# EAGLE design sensorAA (EAGLE 6.4)
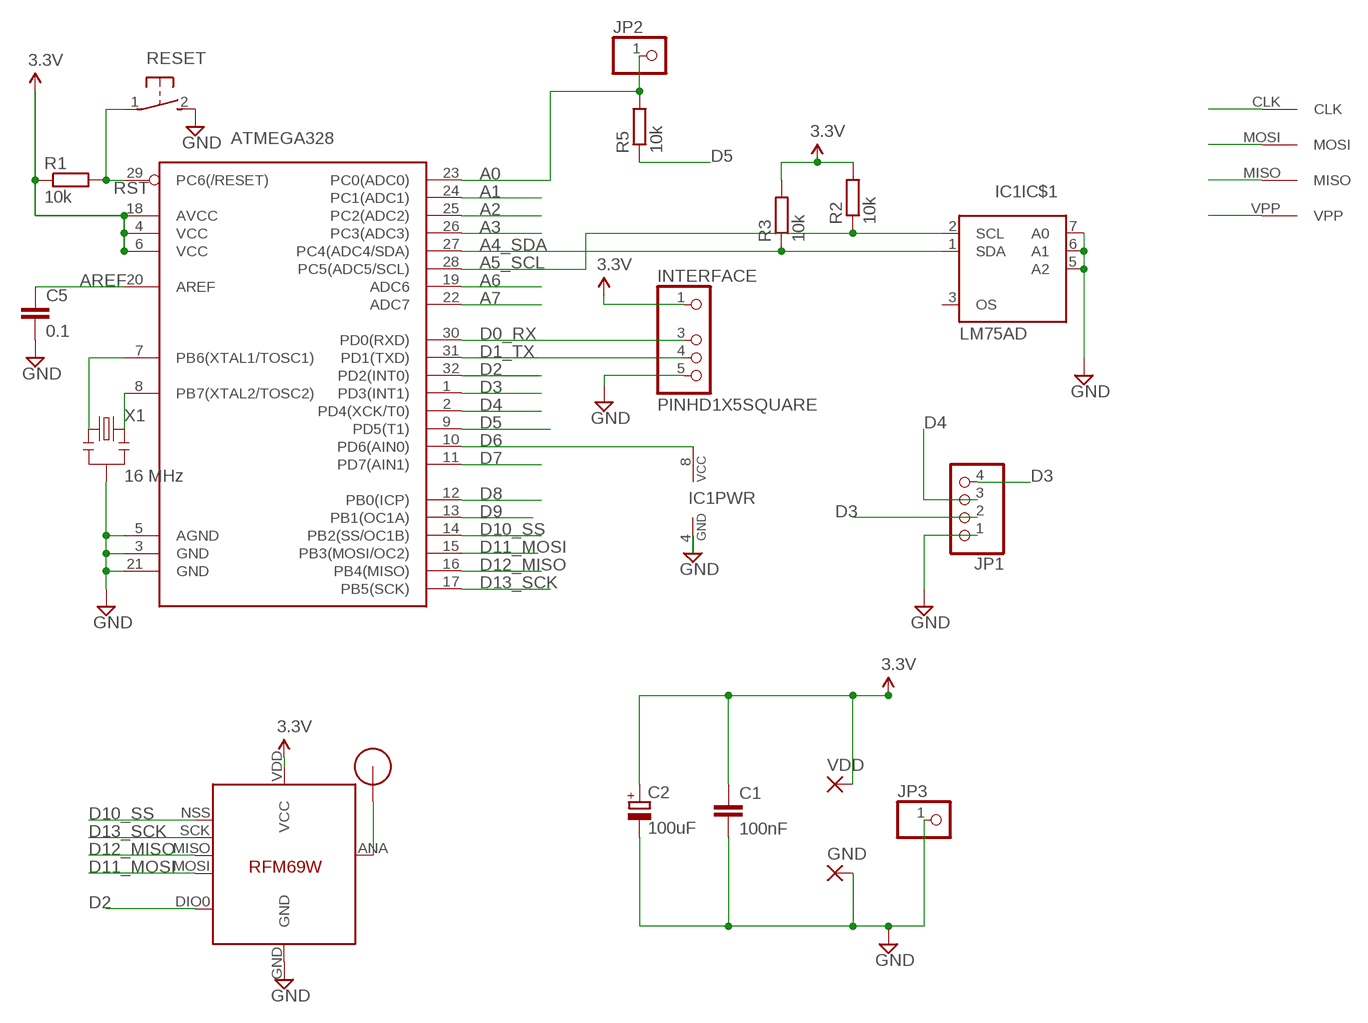
[diagram p0: schematic, sheet 1]

## Parts
ATMEGA328  ATMega-328  ATMEGA168/328TQFP32  [TQFP32-08]
C1  100nF  C-EUC2012  [C2012]
C2  100uF  CPOL-EUSMCB  [SMC_B]
C5  0.1  C-EUC2012  [C2012]
GND  SMD5  [SMD2,54-5,08]
IC1  LM75AD  [SO08]
IC4  RFM69  [RFM69W-MINPADS]
INTERFACE  PINHD1X5SQUARE  [PINHD1X05-SQUARE]
JP1  PINHD-1X04_2.54-S  [1X04-S]
JP2  PINHD-1X01_2.54  [1X01]
JP3  PINHD-1X01_2.54  [1X01]
R1  10k  R-EU_R2012  [R2012]
R2  10k  R-EU_R2012  [R2012]
R3  10k  R-EU_R2012  [R2012]
R5  10k  R-EU_R2012  [R2012]
RESET  DTSM-3  [DTSM-3]
U$1  RFM12B_ANTENNA  [RFM12B-ANTENNA]
U$2  AVRHEADERDIP  [AVRHEADER]
VDD  SMD5  [SMD2,54-5,08]
X1  16 MHz  RESONATORSMD  [RESONATOR-SMD]

## Nets
A0: ATMEGA328.23(PC0(ADC0)) JP2.1 R5.2
A1: ATMEGA328.24(PC1(ADC1))
A2: ATMEGA328.25(PC2(ADC2))
A3: ATMEGA328.26(PC3(ADC3))
A4_SDA: ATMEGA328.27(PC4(ADC4/SDA)) IC1.1(IC$1:SDA) R3.1
A5_SCL: ATMEGA328.28(PC5(ADC5/SCL)) IC1.2(IC$1:SCL) R2.1
A6: ATMEGA328.19(ADC6)
A7: ATMEGA328.22(ADC7)
AREF: ATMEGA328.20(AREF) C5.1
D0_RX: ATMEGA328.30(PD0(RXD)) INTERFACE.3
D1_TX: ATMEGA328.31(PD1(TXD)) INTERFACE.4
D2: ATMEGA328.32(PD2(INT0)) IC4.DIO0
D3: ATMEGA328.1(PD3(INT1)) JP1.2 JP1.4
D4: ATMEGA328.2(PD4(XCK/T0)) JP1.3
D5: ATMEGA328.9(PD5(T1)) R5.1
D6: ATMEGA328.10(PD6(AIN0)) IC1.8(PWR:VCC)
D7: ATMEGA328.11(PD7(AIN1))
D8: ATMEGA328.12(PB0(ICP))
D9: ATMEGA328.13(PB1(OC1A))
D10_SS: ATMEGA328.14(PB2(SS/OC1B)) IC4.NSS(SEL)
D11_MOSI: ATMEGA328.15(PB3(MOSI/OC2)) IC4.MOSI U$2.MOSI
D12_MISO: ATMEGA328.16(PB4(MISO)) IC4.MISO U$2.MISO
D13_SCK: ATMEGA328.17(PB5(SCK)) IC4.SCK U$2.CLK
GND: ATMEGA328.3(GND) ATMEGA328.5(AGND) ATMEGA328.21(GND) C1.2 C2.- C5.2 GND.1(P) IC1.4(PWR:GND) IC1.5(IC$1:A2) IC1.6(IC$1:A1) IC1.7(IC$1:A0) IC4.GND INTERFACE.5 JP1.1 JP3.1 RESET.2 X1.2
N$1: ATMEGA328.7(PB6(XTAL1/TOSC1)) X1.1
N$3: IC4.ANA(ANT) U$1.P$1
N$21: ATMEGA328.8(PB7(XTAL2/TOSC2)) X1.3
RST: ATMEGA328.29(PC6(/RESET)) R1.2 RESET.1 U$2.VPP
VCC: ATMEGA328.4(VCC) ATMEGA328.6(VCC) ATMEGA328.18(AVCC) C1.1 C2.+ IC4.VDD(VCC) INTERFACE.1 R1.1 R2.2 R3.2 VDD.1(P) ; supply symbol labelled 3.3V
Unconnected: IC1.3(IC$1:OS)

## Library data of the parts
ATMEGA328 = LowPowerLab:ATMEGA168/328: Atmel 32-pin 8-bit micro, 16k flash.
C1 C5 = resistor:C-EU: CAPACITOR, European symbol
C2 = resistor:CPOL-EU: POLARIZED CAPACITOR, European symbol
GND VDD = wirepad:SMD5: SMD PAD
IC1 = i2c:LM75AD: Digital Temperature Sensor and Thermal Watchdog
IC4 = LowPowerLab:RFM69
INTERFACE = eagle-library-edeca.net-v5:PINHD1X5
JP1 = pinhead-2:PINHD-1X04: PIN HEADER
JP2 JP3 = pinhead-2:PINHD-1X01: PIN HEADER
R1-R3 R5 = resistor:R-EU_: RESISTOR, European symbol
RESET = switch-tact:DTSM-3
U$1 = LowPowerLab:RFM12B_ANTENNA
U$2 = RemoteHome:AVRHEADER
X1 = SparkFun:RESONATOR: Resonator Small SMD resonator. This is the itty bitty 10/20MHz resonators with built in caps. CSTCE10M0G55 and CSTCE20M0V53. Footprint has been reviewed closely but hasn't been tested yet.

## Net classes
1 power: width 0.381 mm, clearance 0.254 mm

## Board
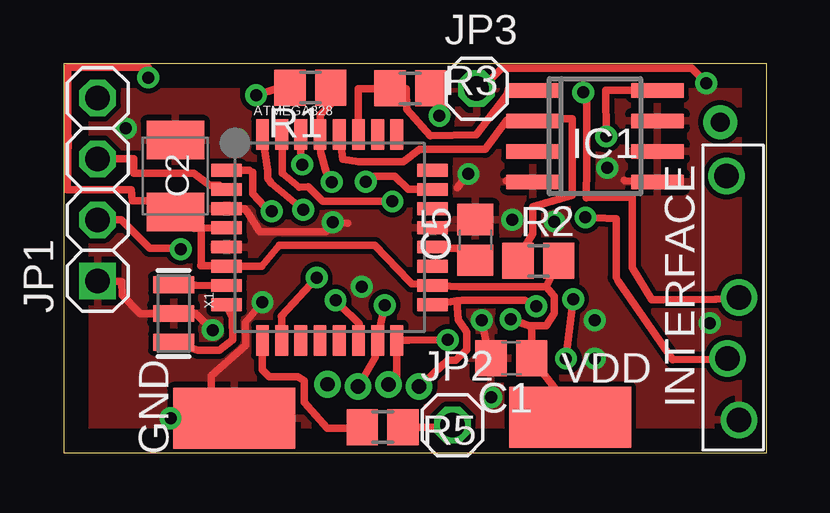
[diagram p1: board, top side]
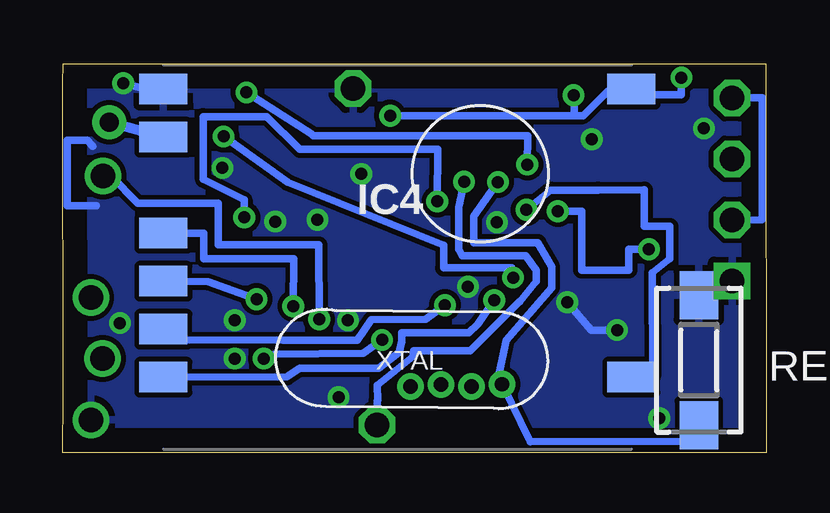
[diagram p2: board, bottom side, seen from below]

Size 29.3 x 16.2 mm. Coordinates in mm from the lower left corner, seen from the top.
Outline: 0,0 29.3,0 29.29,2.34 29.29,15.39 29.29,16.2 0.01,16.2 0,0
Copper layers (1*16): Top 0.035mm / dielectric 1.5mm / Bottom 0.035mm
Design rules "default": minimum track width 10mil, minimum drill 24mil, track to track 8mil, track to pad 8mil, pad to pad 8mil, via to via 8mil, smd to smd 8mil, copper to edge 40mil, drill to drill 8mil, minimum pad ring 10mil, minimum via ring 8mil, stop-mask expansion 4mil, vias tented up to drill 0mil, thermal gap 10mil

### Footprints (pad centres in the part's own frame; a part is rotated, then mirrored left to right if it is on the bottom)
TQFP32-08 = smd 1.27 x 0.533: 1 -4.293,2.8; 2 -4.293,2; 3 -4.293,1.2; 4 -4.293,0.4; 5 -4.293,-0.4; 6 -4.293,-1.2; 7 -4.293,-2; 8 -4.293,-2.8; 17 4.293,-2.8; 18 4.293,-2; 19 4.293,-1.2; 20 4.293,-0.4; 21 4.293,0.4; 22 4.293,1.2; 23 4.293,2; 24 4.293,2.8 | smd 0.533 x 1.27: 9 -2.8,-4.293; 10 -2,-4.293; 11 -1.2,-4.293; 12 -0.4,-4.293; 13 0.4,-4.293; 14 1.2,-4.293; 15 2,-4.293; 16 2.8,-4.293; 25 2.8,4.293; 26 2,4.293; 27 1.2,4.293; 28 0.4,4.293; 29 -0.4,4.293; 30 -1.2,4.293; 31 -2,4.293; 32 -2.8,4.293
C2012 = smd 1.3 x 1.5: 1 -0.85,0; 2 0.85,0
SMC_B = smd 1.6 x 2.4: + -1.5,0; - 1.5,0
SMD2,54-5,08 = smd 2.54 x 5.08: 1 0,0
SO08 = smd 0.6 x 2.2: 1 -1.905,-2.6; 2 -0.635,-2.6; 3 0.635,-2.6; 4 1.905,-2.6; 5 1.905,2.6; 6 0.635,2.6; 7 -0.635,2.6; 8 -1.905,2.6
RFM69W-MINPADS = smd 2 x 1.27: ANA 8,-5; DIO0 -11.5,5; GND 8,-7; MISO 8,1; MOSI 8,3; NSS 8,5; SCK 8,-1; VDD -11.5,-7
PINHD1X05-SQUARE = drill 1.016: 1 -5.061,-0.269; 3 0,0.24; 4 2.54,-0.24; 5 5.099,0.24
1X04-S = drill 1.016 square: 1 -3.81,0 | drill 1.016 octagon: 2 -1.27,0; 3 1.27,0; 4 3.81,0
1X01 = drill 1.016 octagon: 1 0,0
R2012 = smd 1.3 x 1.5: 1 -0.85,0; 2 0.85,0
DTSM-3 = smd 2 x 1.6: 1 -2.7,0; 2 2.7,0
RFM12B-ANTENNA = drill 0.8 pad 1.422: P$1 0,0
AVRHEADER = drill 0.6 pad 0.813: CLK 2.54,0; MISO 1.27,0.091; MOSI 0,0; VPP -1.27,0.099
RESONATOR-SMD = smd 0.7 x 1.7: 1 -1.2,0; 2 0,0; 3 1.2,0

### Placement (x,y rotation side)
ATMEGA328  11.09,8.96 0 top
C1  18.66,3.93 180 top
C2  4.65,11.52 90 top
C5  17.16,8.86 90 top
GND  7.1,1.42 90 top
IC1  22.14,13.18 270 top
IC4  17.11,8.15 180 bottom
INTERFACE  27.9,6.46 270 top
JP1  1.41,10.96 90 top
JP2  16.2,1.15 0 top
JP3  17.2,15.17 0 top
R1  10.28,15.21 0 top
R2  19.78,7.99 0 top
R3  14.44,15.17 0 top
R5  13.29,1.06 0 top
RESET  2.8,3.85 90 bottom
U$1  27.36,13.77 0 top
U$2  12.27,2.74 0 top
VDD  21.1,1.47 90 top
X1  4.58,5.8 270 top

### Tracks (layer width: path | path; a pad name or v marks a point on that pad's centre or on a via)
A0  (via drill 0.5)
  Top 0.305: ATMEGA328.23 14.35,10.96 13.8,11.51 12.95,11.51 v12.58,11.28 | R5.2 16.12,1.06 JP2.1
  Bottom 0.305: v12.58,11.28 12.79,10.22 12.81,10.09 12.81,8.92 12.81,8.81 12.81,8.47 12.66,8.2 10.01,8.2 9.57,7.6 9.57,7.15 10.27,6.28 10.29,6.28 12.33,4.25 14.69,4.24 14.69,4.02 16.19,2.8 16.18,2.19 16.2,2.16 JP2.1
A4_SDA
  Top 0.305: IC1.1 18.55,15.19 18.49,14.94 17.2,13.23 15.27,13.19 14.3,14.29 14.28,15.15 R3.1 14.03,15.15 12.29,15.15 ATMEGA328.27
A5_SCL
  Top 0.305: ATMEGA328.28 11.5,13.24 11.64,12.23 12.3,12.12 14.16,12.12 14.83,12.65 17.56,12.63 18.45,13.85 IC1.2 18.84,13.91 21.18,13.91 21.18,10.73 19.54,10.24 19.54,9.13 18.92,8.09 R2.1
AREF
  Top 0.305: ATMEGA328.20 15.43,8.51 16.41,8.51 17.01,7.91 C5.1
D0_RX  (via drill 0.5)
  Top 0.305: ATMEGA328.30 9.89,12.22 v9.95,12 | v21.65,15.01 21.8,15.01 21.79,14.23 21.79,12.05 21.79,11.93 21.77,10.61 23.7,10.64 23.69,7.71 24.51,6.37 | 24.99,6.37 24.51,6.37 | 24.51,6.37 27.17,6.39 INTERFACE.3
  Bottom 0.305: v9.95,12 9.93,13.21 10.24,13.2 18.86,13.2 18.95,13.29 v21.65,15.01
D1_TX  (via drill 0.5)
  Top 0.305: v13.7,10.46 10.8,10.46 10.18,11.08 9.83,11.05 9.11,11.63 9.1,13.24 ATMEGA328.31 | v21.74,9.79 23.02,9.75 23.03,7.3 23.11,7.14 25.39,3.86 27.2,3.89 INTERFACE.4
  Bottom 0.305: v13.7,10.46 13.7,10.51 13.69,10.52 13.68,12.63 19.43,12.63 20.8,14 23.46,14 23.45,11.38 21.74,10.53 v21.74,9.79
D2  (via drill 0.5)
  Top 0.305: ATMEGA328.32 8.5,11.75 8.51,11.44 8.65,11.22 v9.99,10.11
  Bottom 0.305: v9.99,10.11 8.96,10.94 7.01,10.94 6.99,10.93 5.07,10.95 5.07,9.43 4,9.43 4.01,8.07 4.74,7.5 4.72,3.17 IC4.DIO0
D3  (via drill 0.5)
  Top 0.305: v8.68,10.06 8.61,9.99 7.87,10.79 7.87,11.68 7.74,11.77 ATMEGA328.1 | JP1.2 2.39,9.69 3.58,8.51 4.85,8.51 v4.88,8.48
  Bottom 0.305: v8.68,10.06 7.69,10.06 7.68,9.57 7.68,7.6 5.71,7.6 5.72,8.48 v4.88,8.48 | JP1.4 0.16,14.77 0.15,14.78 0.15,9.71 0.18,9.7 JP1.2
D4
  Top 0.305: JP1.3 2.93,12.23 2.93,11.64 5.42,11.64 6.09,11.14 6.48,11.14 ATMEGA328.2
D5
  Top 0.305: ATMEGA328.9 8.29,3.46 8.57,3.17 9.75,3.17 10.02,3 10.02,2.09 10.99,1.01 12.4,1.01 R5.1
D6  (via drill 0.5)
  Top 0.305: IC1.8 22.6,15.09 v22.6,13.17 | v10.54,7.29 9.07,5.69 9.09,5.64 ATMEGA328.10
  Bottom 0.305: v22.6,13.17 22.13,12.84 19.94,11.25 13.44,8.64 13.44,7.69 11.38,7.69 10.6,7.7 v10.54,7.29
D10_SS  (via drill 0.5)
  Top 0.305: v11.33,6.34 11.51,6.17 12.31,5.37 12.33,4.71 ATMEGA328.14
  Bottom 0.305: IC4.NSS 19.96,3.15 19.43,3.51 16.15,3.51 15.28,4.17 15.18,4.65 15.18,4.99 14.65,4.98 14.35,4.99 14.05,4.98 12.38,4.98 12.01,5.35 v11.33,6.34
D11_MOSI  (via drill 0.5)
  Top 0.305: v13.38,6.14 13.06,4.69 ATMEGA328.15 12.99,3.97 U$2.MOSI
  Bottom 0.305: IC4.MOSI 24.34,4.7 20.12,4.68 17.04,4.68 16.44,5.54 14.17,5.54 v13.38,6.14
D12_MISO  (via drill 0.5)
  Top 0.305: v21.23,6.39 v20.93,3.91 | v16,4.69 14.37,4.68 ATMEGA328.16 | U$2.MISO 13.87,3.07 13.89,3.53 ATMEGA328.16 | ATMEGA328.16
  Bottom 0.305: IC4.MISO 23.25,7.11 v21.23,6.39 | v20.93,3.91 20.65,3.92 20.5,4.1 16.78,4.13 v16,4.69
D13_SCK  (via drill 0.5)
  Top 0.305: v19.7,6.1 19.21,6.35 18.56,6.34 16.61,6.35 16.39,6.31 | 16.39,6.31 ATMEGA328.17 | U$2.CLK 16,3.85 16.33,3.85 16.79,4.28 16.8,5.01 16.74,5.12 16.45,5.53 16.39,6.31
  Bottom 0.305: IC4.SCK 23.44,9.15 23.43,8.07 19.69,8.08 v19.7,6.1
GND  (via drill 0.5)
  Top 0.305: IC1.4 18.44,11.33 | ATMEGA328.21 | GND.1 6.24,1.44 5.81,1.44 v4.45,1.43 6.18,1.43 6.18,1.98 6.16,3.2 7.58,4.48 7.56,5.4 v8.28,6.27 | IC1.5 23.38,11.33 23.36,11.35 | ATMEGA328.3 7.54,10.17 7.69,9.97 8.16,9.19 8.9,9.2 10.29,9.2 10.93,9.19 11.33,9.62 v11.21,9.59 11.5,9.57 11.85,9.56 | v6.21,5.11 5.48,5.8 X1.2 3.19,5.79 2.44,6.55 2.43,7.13 JP1.1 | v17.42,5.51 17.67,4.27 C1.2 | v16.87,11.61 16.41,11.03 | JP3.1 17.42,15.17 18.26,16.01 26.16,16.01 v26.78,15.39
  Bottom 0.305: IC4.GND 25.83,15.15 v26.78,15.39 | v6.21,5.11 7.28,5.11 v8.28,6.27 | 27.9,10.29 29.11,10.29 29.11,13.01 28.29,13.01 28.05,12.77 | JP1.1 2.92,7.12 RESET.2
  other vias: 18.69,9.7 12.42,6.91 22.65,11.86 20.45,9.62 17.81,2.31 22.13,5.51 22.13,3.92 26.92,5.4 7.26,13.06 2.59,13.5
  pour Top: 0.2,16.05 29.17,16.03 29.1,0.18 0.2,0.22
  pour Bottom: 0.16,16.02 29.12,16.04 29.12,0.15 0.2,0.17
N$1
  Top 0.305: X1.1 5,6.99 5.49,6.97 6.79,6.95 ATMEGA328.7
N$3
  Bottom 0.406: IC4.ANA U$1.P$1
N$21
  Top 0.305: X1.3 5.59,4.26 6.49,4.26 7.04,4.71 7.04,5.62 6.78,6.15 ATMEGA328.8
RST  (via drill 0.5)
  Top 0.305: 10.66,13.28 ATMEGA328.29 | v11.17,11.27 10.95,11.68 10.72,12.5 10.67,13.24 ATMEGA328.29 | R1.2 11.57,14.96 10.69,14.08 ATMEGA328.29
  Bottom 0.305: v11.17,11.27 12.19,9.84 12.19,9.2 12.18,8.75 9.51,8.75 8.94,7.73 8.94,6.87 10.84,4.69 11.12,3.33 11.13,3.05 U$2.VPP 9.83,0.45 2.94,0.47 2.94,1.15 RESET.1
VCC  (via drill 0.5)
  Top 0.305: VDD.1 20.9,1.38 20.93,2.08 | 20.1,2.08 20.93,2.08 | ATMEGA328.4 5.75,9.35 | 5.75,9.35 5.73,9.21 5.73,7.91 5.72,7.77 ATMEGA328.6 8.26,7.76 8.97,8.65 12.97,8.63 14.4,7.14 14.5,7.03 15.34,7 ATMEGA328.18 16.48,6.91 20.1,6.91 | 20.87,7.83 20.68,7.93 R2.2 20.1,6.91 | R3.2 15.98,14.08 v15.66,14.04 | 20.93,2.08 20.68,2.38 C1.1 19.51,5.25 v18.62,5.55 19.41,5.28 20.1,5.28 20.45,5.8 20.45,6.52 20.1,6.91 | 5.75,9.35 5.42,9.35 4.99,9.92 4.52,10.5 4.29,10.5 | 4.29,10.5 2.85,10.49 2.82,10.96 0.15,10.96 0.19,13.2 0.16,13.22 0.16,16.05 3.53,16.05 v3.53,15.63 | 27.89,11.53 INTERFACE.1 | R1.1 8.92,15.19 v8.02,14.89 | C2.+ 4.29,10.14 4.29,10.5
  Bottom 0.305: v15.66,14.04 8.32,14.04 | 8.32,14.04 7.62,14.04 6.59,15.06 5.61,15.06 5.61,15.07 IC4.VDD 4.98,14.9 3.53,14.9 v3.53,15.63 | INTERFACE.1 27.86,11.54 27.86,11.5 27.28,11.5 26.18,10.4 22.82,10.4 22.82,8.66 18.64,8.65 v18.62,5.55 | v8.02,14.89 8,14.04 8.32,14.04